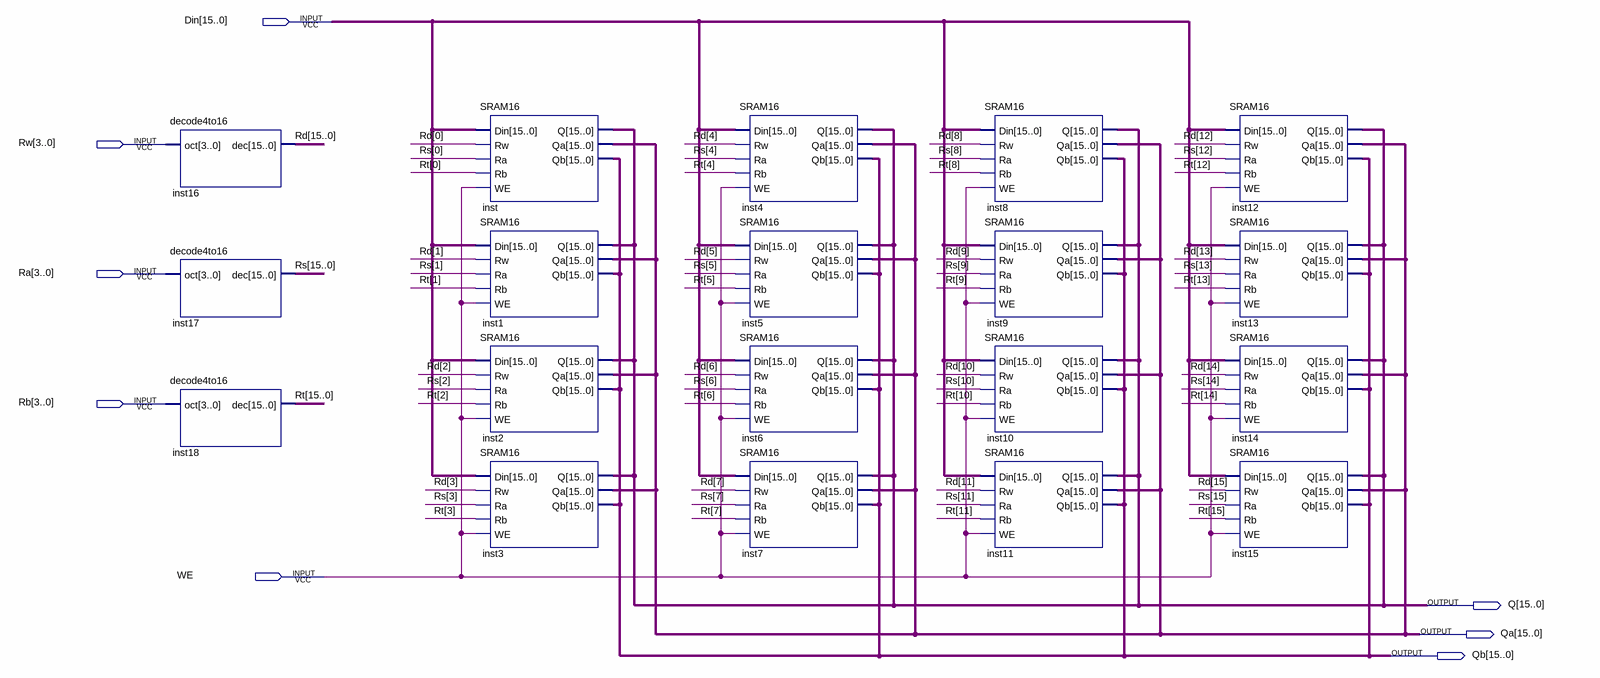
[diagram p0: schematic sheet]
// Quartus schematic 16x16_register.bdf as structural Verilog: 19 symbols, 8 pins
module \16x16_register  (
  input  [15:0] Din,
  input  [3:0] Rw,
  input  [3:0] Ra,
  input  [3:0] Rb,
  input  WE,
  output [15:0] Q,
  output [15:0] Qa,
  output [15:0] Qb
);

  wire [15:0] Rd, Rs, Rt;

  decode4to16 inst16 (.oct(Rw), .dec(Rd));
  decode4to16 inst17 (.oct(Ra), .dec(Rs));
  decode4to16 inst18 (.oct(Rb), .dec(Rt));
  SRAM16 inst (.Din(Din), .Rw(Rd[0]), .Ra(Rs[0]), .Rb(Rt[0]), .WE(WE), .Q(Q), .Qa(Qa), .Qb(Qb));
  SRAM16 inst1 (.Din(Din), .Rw(Rd[1]), .Ra(Rs[1]), .Rb(Rt[1]), .WE(WE), .Q(Q), .Qa(Qa), .Qb(Qb));
  SRAM16 inst2 (.Din(Din), .Rw(Rd[2]), .Ra(Rs[2]), .Rb(Rt[2]), .WE(WE), .Q(Q), .Qa(Qa), .Qb(Qb));
  SRAM16 inst3 (.Din(Din), .Rw(Rd[3]), .Ra(Rs[3]), .Rb(Rt[3]), .WE(WE), .Q(Q), .Qa(Qa), .Qb(Qb));
  SRAM16 inst4 (.Din(Din), .Rw(Rd[4]), .Ra(Rs[4]), .Rb(Rt[4]), .WE(WE), .Q(Q), .Qa(Qa), .Qb(Qb));
  SRAM16 inst5 (.Din(Din), .Rw(Rd[5]), .Ra(Rs[5]), .Rb(Rt[5]), .WE(WE), .Q(Q), .Qa(Qa), .Qb(Qb));
  SRAM16 inst6 (.Din(Din), .Rw(Rd[6]), .Ra(Rs[6]), .Rb(Rt[6]), .WE(WE), .Q(Q), .Qa(Qa), .Qb(Qb));
  SRAM16 inst7 (.Din(Din), .Rw(Rd[7]), .Ra(Rs[7]), .Rb(Rt[7]), .WE(WE), .Q(Q), .Qa(Qa), .Qb(Qb));
  SRAM16 inst8 (.Din(Din), .Rw(Rd[8]), .Ra(Rs[8]), .Rb(Rt[8]), .WE(WE), .Q(Q), .Qa(Qa), .Qb(Qb));
  SRAM16 inst9 (.Din(Din), .Rw(Rd[9]), .Ra(Rs[9]), .Rb(Rt[9]), .WE(WE), .Q(Q), .Qa(Qa), .Qb(Qb));
  SRAM16 inst10 (.Din(Din), .Rw(Rd[10]), .Ra(Rs[10]), .Rb(Rt[10]), .WE(WE), .Q(Q), .Qa(Qa), .Qb(Qb));
  SRAM16 inst11 (.Din(Din), .Rw(Rd[11]), .Ra(Rs[11]), .Rb(Rt[11]), .WE(WE), .Q(Q), .Qa(Qa), .Qb(Qb));
  SRAM16 inst12 (.Din(Din), .Rw(Rd[12]), .Ra(Rs[12]), .Rb(Rt[12]), .WE(WE), .Q(Q), .Qa(Qa), .Qb(Qb));
  SRAM16 inst13 (.Din(Din), .Rw(Rd[13]), .Ra(Rs[13]), .Rb(Rt[13]), .WE(WE), .Q(Q), .Qa(Qa), .Qb(Qb));
  SRAM16 inst14 (.Din(Din), .Rw(Rd[14]), .Ra(Rs[14]), .Rb(Rt[14]), .WE(WE), .Q(Q), .Qa(Qa), .Qb(Qb));
  SRAM16 inst15 (.Din(Din), .Rw(Rd[15]), .Ra(Rs[15]), .Rb(Rt[15]), .WE(WE), .Q(Q), .Qa(Qa), .Qb(Qb));
endmodule
